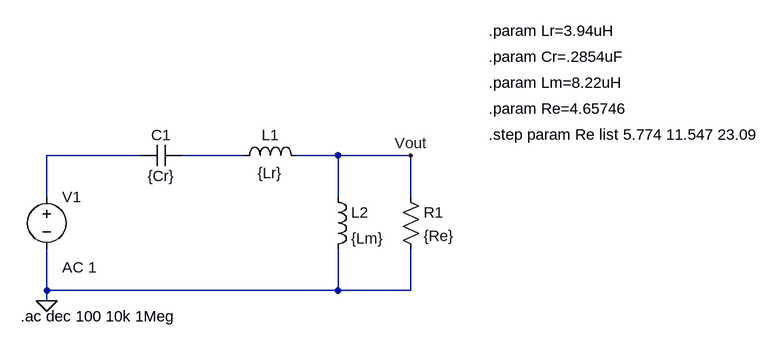
[diagram p0: schematic Resonant Tank at different Loads.asc]
Resonant Tank at different Loads.asc, the LTspice schematic file:
Version 4.1
SHEET 1 1304 680
WIRE 256 80 112 80
WIRE 416 80 320 80
WIRE 560 80 496 80
WIRE 672 80 560 80
WIRE 112 144 112 80
WIRE 560 144 560 80
WIRE 672 144 672 80
WIRE 112 288 112 224
WIRE 560 288 560 224
WIRE 560 288 112 288
WIRE 672 288 672 224
WIRE 672 288 560 288
WIRE 112 304 112 288
FLAG 112 304 0
FLAG 672 80 Vout
SYMBOL voltage 112 128 R0
WINDOW 123 24 124 Left 2
WINDOW 39 0 0 Left 0
SYMATTR Value2 AC 1
SYMATTR InstName V1
SYMATTR Value ""
SYMBOL cap 320 64 R90
WINDOW 0 0 32 VBottom 2
WINDOW 3 32 32 VTop 2
SYMATTR InstName C1
SYMATTR Value {Cr}
SYMBOL ind 400 96 R270
WINDOW 0 32 56 VTop 2
WINDOW 3 5 56 VBottom 2
SYMATTR InstName L1
SYMATTR Value {Lr}
SYMATTR SpiceLine Rser=1m
SYMBOL ind 544 128 R0
SYMATTR InstName L2
SYMATTR Value {Lm}
SYMATTR SpiceLine Rser=1m
SYMBOL res 656 128 R0
SYMATTR InstName R1
SYMATTR Value {Re}
TEXT 792 -112 Left 2 !.param Lr=3.94uH
TEXT 792 -72 Left 2 !.param Cr=.2854uF
TEXT 792 -32 Left 2 !.param Lm=8.22uH
TEXT 792 8 Left 2 !.param Re=4.65746
TEXT 72 328 Left 2 !.ac dec 100 10k 1Meg
TEXT 792 48 Left 2 !.step param Re list 5.774 11.547 23.09

The netlist it stands for:
* Resonant Tank at different Loads.asc
V1 N001 0 AC 1
C1 N002 N001 {Cr}
L1 N002 Vout {Lr} Rser=1m
L2 Vout 0 {Lm} Rser=1m
R1 Vout 0 {Re}
.param Lr=3.94uH
.param Cr=.2854uF
.param Lm=8.22uH
.param Re=4.65746
.ac dec 100 10k 1Meg
.step param Re list 5.774 11.547 23.09
.backanno
.end